# Altium schematic sheet pwr.SchDoc
size A4; SheetNumber: 10; SheetTotal: 14
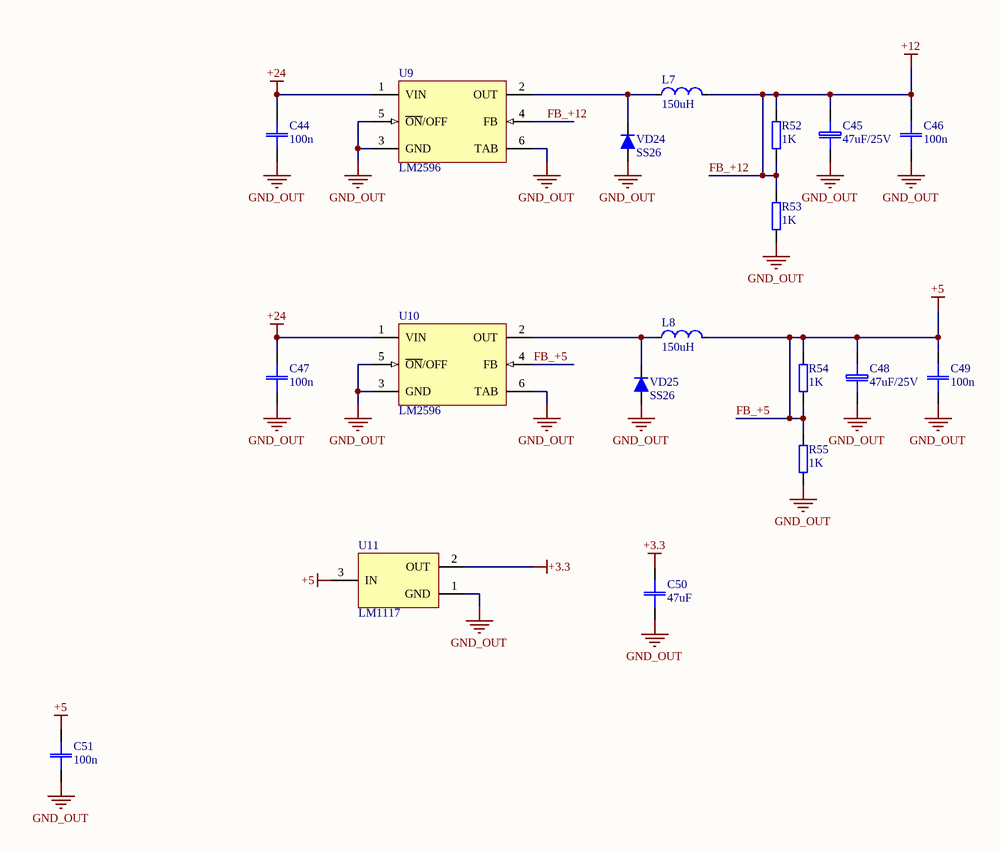
[diagram p0: pwr.SchDoc]

## Parts
C44  100n  [CAP: 1206]
C45  47uF/25V  [CAP: TANTAL-C]
C46  100n  [CAP: 0805]
C47  100n  [CAP: 1206]
C48  47uF/25V  [CAP: TANTAL-C]
C49  100n  [CAP: 0805]
C50  47uF  [CAP: 0805]
C51  100n  [CAP: 0805]
L7  150uH  [IND: SRP1265A]
L8  150uH  [IND: SRP1265A]
R52  1K  [RES: 0603]
R53  1K  [RES: 0603]
R54  1K  [RES: 0603]
R55  1K  [RES: 0603]
U9  LM2596  [POW: D2PAK-5]
U10  LM2596  [POW: D2PAK-5]
U11  LM1117  [SOT223]
VD24  SS26  [DIODE: SMA]
VD25  SS26  [DIODE: SMA]

## Nets
+3.3: C50.2 U11.2(OUT)
+24: C44.2 C47.2 U9.1(VIN) U10.1(VIN)
FB_+5: C48.1(+) C49.2 C51.2 L8.2 R54.1 R54.2 R55.1 U10.4(FB) U11.3(IN)  [also labelled +5]
FB_+12: C45.1(+) C46.2 L7.2 R52.1 R52.2 R53.1 U9.4(FB)  [also labelled +12]
GND_OUT: C44.1 C45.2(-) C46.1 C47.1 C48.2(-) C49.1 C50.1 C51.1 R53.2 R55.2 U9.3(GND) U9.5(~{ON}/OFF) U9.6(TAB) U10.3(GND) U10.5(~{ON}/OFF) U10.6(TAB) U11.1(GND) VD24.1(A) VD25.1(A)
NetL7_1: L7.1 U9.2(OUT) VD24.2(C)
NetL8_1: L8.1 U10.2(OUT) VD25.2(C)

## Library data of the parts
C44 C46 C47 C49-C51 = C_SMD
  C44 C46 C47 C49 C51: Value: 100n
  C50: Value: 47uF
C45 C48 = C_TANTAL: Value: 47uF/25V
L7 L8 = L_SMD: Value: 150uH
R52-R55 = R_SMD: Value: 1K
VD24 VD25 = DIODE_SMD: Value: SS26
U9 U10 = LM2596: Value: LM2596
U11 = LM1117: Value: LM1117